# Altium schematic sheet DHT11_蓝牙模块_蜂鸣器.SchDoc
size A3
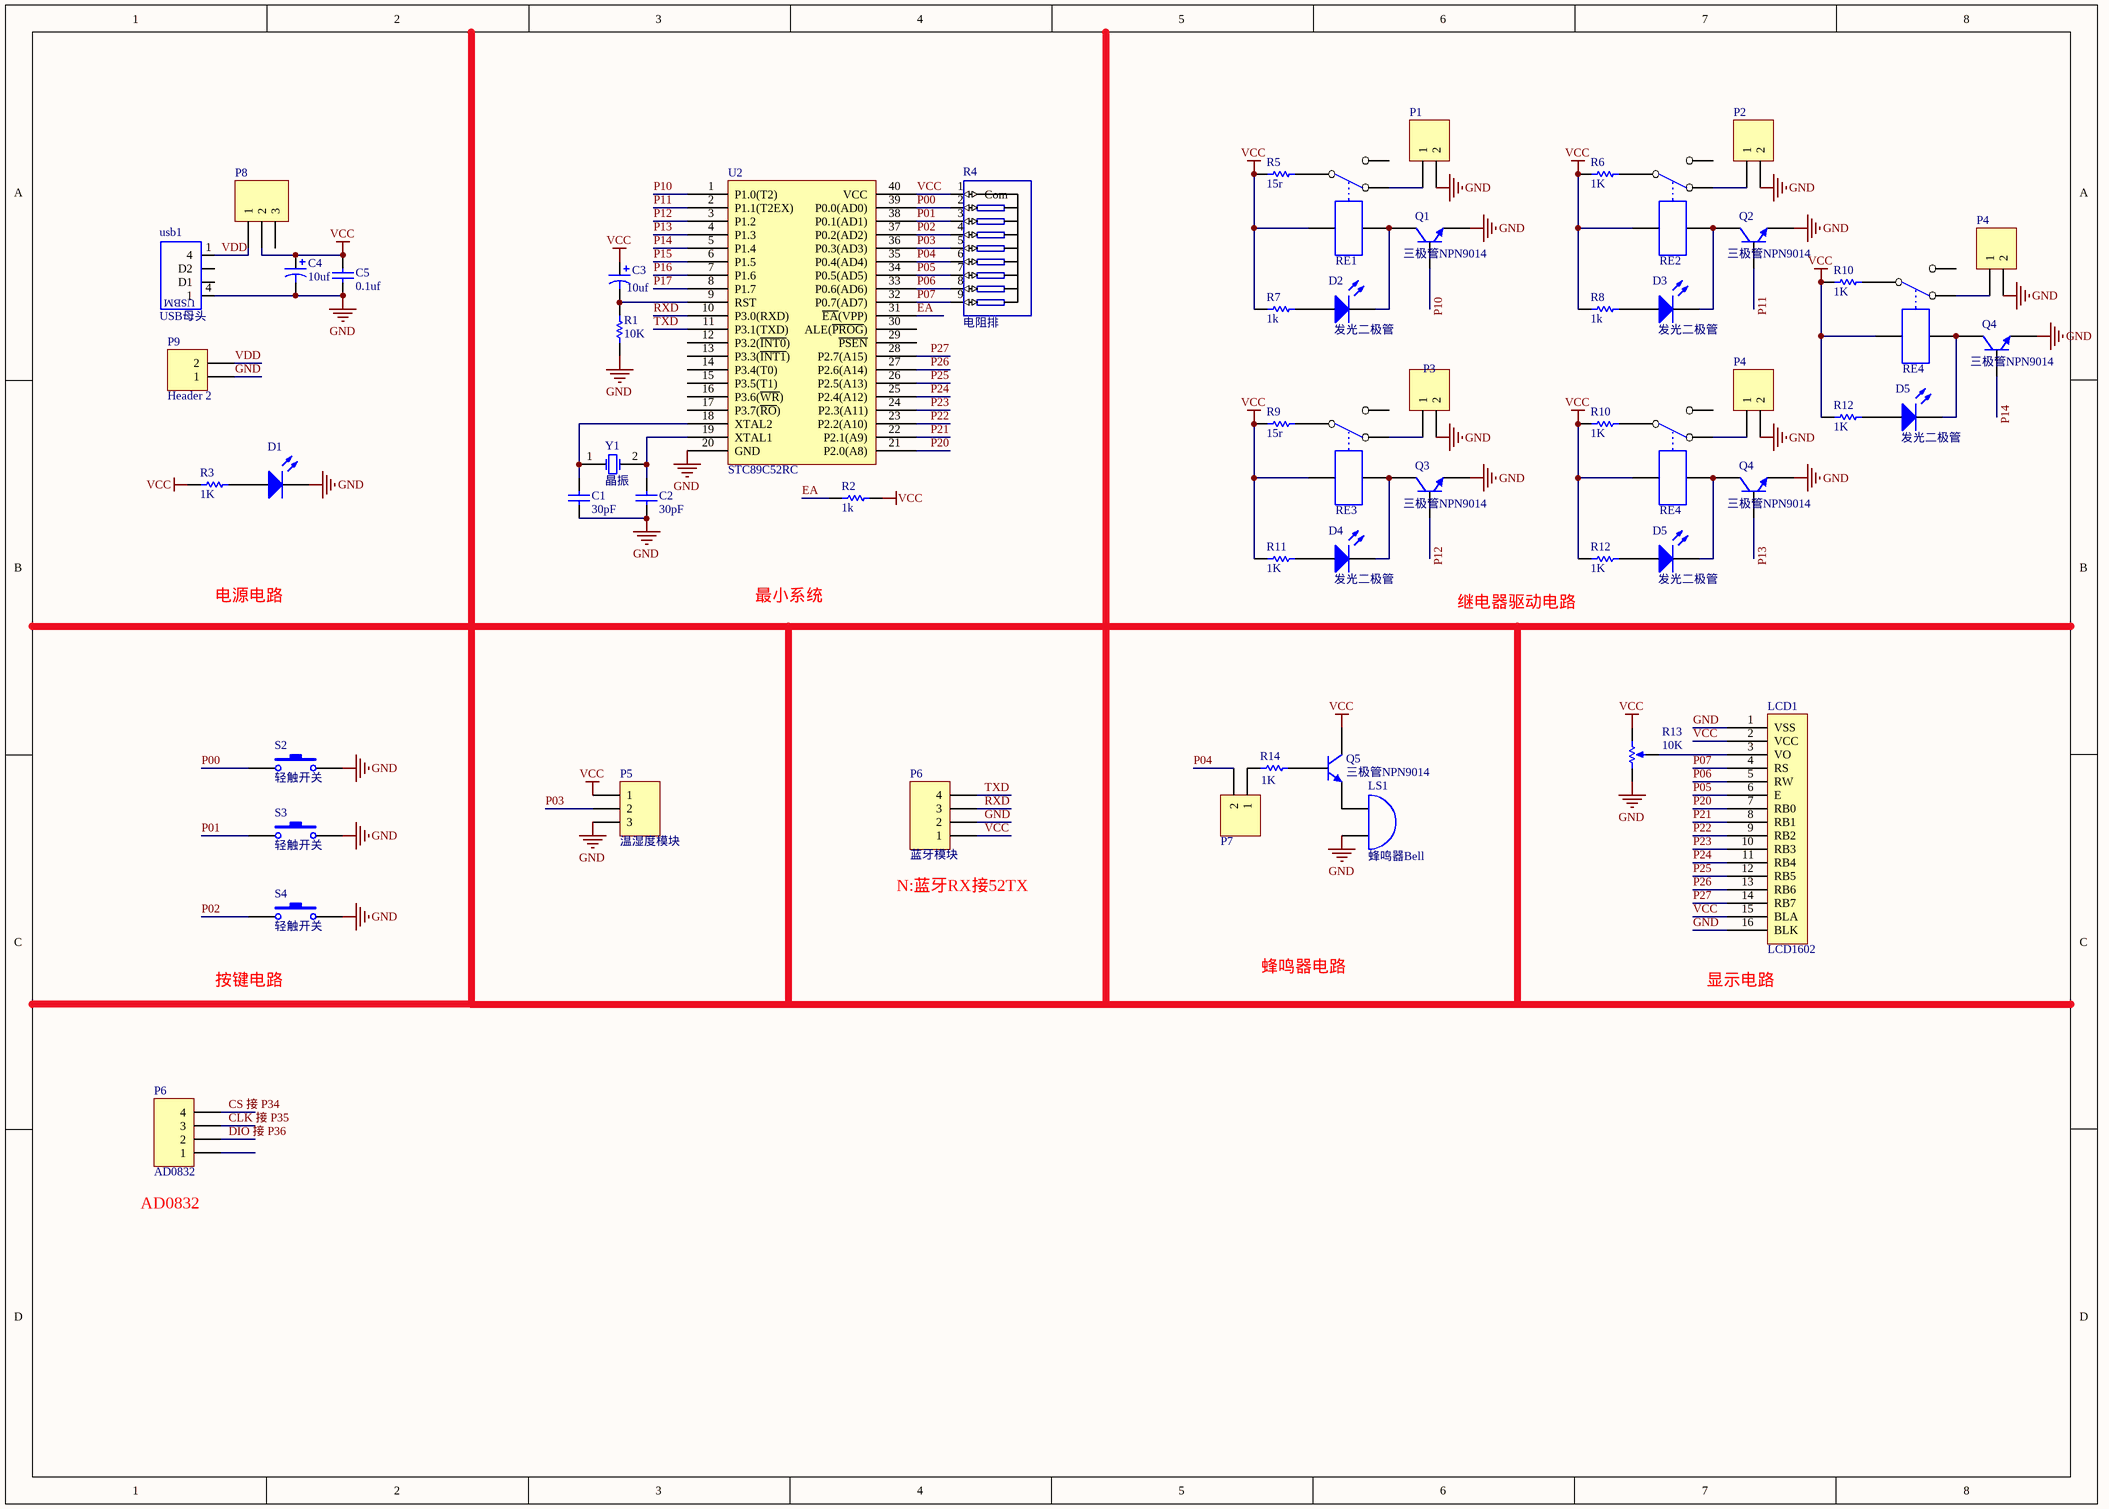
[diagram p0: DHT11_蓝牙模块_蜂鸣器.SchDoc]

## Parts
(Parts that share a designator on the sheet are numbered #1, #2 ... from top to bottom, then left to right.)
C1  value 30pF  [RAD-0.1]  (hidden comment: 瓷片电容)
C2  value 30pF  [RAD-0.1]  (hidden comment: 瓷片电容)
C3  value 10uf  [10UF]  (hidden comment: 电解电容)
C4  value 10uf  [10UF]  (hidden comment: 点解电容)
C5  value 0.1uf  [CB1]  (hidden comment: 瓷片电容)
D1  发光二极管  [LED_2.54]  (value not drawn)
D2  发光二极管  [LED_2.54]
D3  发光二极管  [LED_2.54]
D4  发光二极管  [LED_2.54]
D5#1  发光二极管  [LED_2.54]
D5#2  发光二极管  [LED_2.54]
LCD1  LCD1602  [1602LCD]
LS1  蜂鸣器Bell  [有源蜂鸣器4.9]
P1  接线端子  [端子2P]  (value not drawn)
P2  接线端子  [端子2P]  (value not drawn)
P3  接线端子  [端子2P]  (value not drawn)
P4#1  接线端子  [端子2P]  (value not drawn)
P4#2  接线端子  [端子2P]  (value not drawn)
P5  温湿度模块  [HDR1X3]
P6#1  蓝牙模块  [HDR1X4]
P6#2  AD0832  [HDR1X4]
P7  Header 2  [HDR1X2]  (value not drawn)
P8  Header 3  [HDR1X3]  (value not drawn)
P9  Header 2  [HDR1X2]
Q1  三极管NPN9014  [NEWTO-92]
Q2  三极管NPN9014  [NEWTO-92]
Q3  三极管NPN9014  [NEWTO-92]
Q4#1  三极管NPN9014  [NEWTO-92]
Q4#2  三极管NPN9014  [NEWTO-92]
Q5  三极管NPN9014  [NEWTO-92]
R1  value 10K  [电阻0.7-1.6]  (hidden comment: 电阻)
R2  value 1k  [电阻0.7-1.6]  (hidden comment: 电阻)
R3  value 1K  [电阻0.7-1.6]  (hidden comment: 电阻)
R4  电阻排  [插槽P9]
R5  value 15r  [电阻0.7-1.6]  (hidden comment: 电阻)
R6  value 1K  [电阻0.7-1.6]  (hidden comment: 电阻)
R7  value 1k  [电阻0.7-1.6]  (hidden comment: 电阻)
R8  value 1k  [电阻0.7-1.6]  (hidden comment: 电阻)
R9  value 15r  [电阻0.7-1.6]  (hidden comment: 电阻)
R10#1  value 1K  [电阻0.7-1.6]  (hidden comment: 电阻)
R10#2  value 1K  [电阻0.7-1.6]  (hidden comment: 电阻)
R11  value 1K  [电阻0.7-1.6]  (hidden comment: 电阻)
R12#1  value 1K  [电阻0.7-1.6]  (hidden comment: 电阻)
R12#2  value 1K  [电阻0.7-1.6]  (hidden comment: 电阻)
R13  value 10K  [可调电阻5mm]  (hidden comment: 电位器RPot)
R14  value 1K  [电阻0.7-1.6]  (hidden comment: 电阻)
RE1  继电器  [继电器5V]  (value not drawn)
RE2  继电器  [继电器5V]  (value not drawn)
RE3  继电器  [继电器5V]  (value not drawn)
RE4#1  继电器  [继电器5V]  (value not drawn)
RE4#2  继电器  [继电器5V]  (value not drawn)
S2  轻触开关  [轻触开关小]
S3  轻触开关  [轻触开关小]
S4  轻触开关  [轻触开关小]
U2  STC89C52RC  [DIP-40W]
usb1  USB母头  [A母USB]
Y1  晶振  [XTAL]

## Nets
GND: C1.1 C2.1 C4.2 C5.1 D1.2(K) LCD1.1(VSS) LCD1.16(BLK) LS1.2(B) P1.2 P2.2 P3.2 P4#1.2 P4#2.2 P5.3 P6#1.2 P9.1 Q1.3(E) Q2.3(E) Q3.3(E) Q4#1.3(E) Q4#2.3(E) R1.1 R13.1(TOP) S2.2 S3.2 S4.2 U2.20(GND) usb1.4(1)
VCC: C3.1 C4.1 C5.2 LCD1.2(VCC) LCD1.15(BLA) P5.1 P6#1.1 P8.2 Q5.1(C) R2.1 R3.2 R4.1(Com) R5.1 R6.1 R7.2 R8.2 R9.1 R10#1.1 R10#2.1 R11.2 R12#1.2 R12#2.2 R13.2(BOT) RE1.4 RE2.4 RE3.4 RE4#1.4 RE4#2.4 U2.40(VCC)
CLK 接 P35: P6#2.3
CS 接 P34: P6#2.4
DIO 接 P36: P6#2.2
EA: R2.2 U2.31(~{EA}(VPP))
P00: R4.2 S2.1 U2.39(P0.0(AD0))
P01: R4.3 S3.1 U2.38(P0.1(AD1))
P02: R4.4 S4.1 U2.37(P0.2(AD2))
P03: P5.2 R4.5 U2.36(P0.3(AD3))
P04: P7.2 R4.6 U2.35(P0.4(AD4))
P05: LCD1.6(E) R4.7 U2.34(P0.5(AD5))
P06: LCD1.5(RW) R4.8 U2.33(P0.6(AD6))
P07: LCD1.4(RS) R4.9 U2.32(P0.7(AD7))
P10: Q1.2(B) U2.1(P1.0(T2))
P11: Q2.2(B) U2.2(P1.1(T2EX))
P12: Q3.2(B) U2.3(P1.2)
P13: Q4#2.2(B) U2.4(P1.3)
P14: Q4#1.2(B) U2.5(P1.4)
P15: U2.6(P1.5)
P16: U2.7(P1.6)
P17: U2.8(P1.7)
P20: LCD1.7(RB0) U2.21(P2.0(A8))
P21: LCD1.8(RB1) U2.22(P2.1(A9))
P22: LCD1.9(RB2) U2.23(P2.2(A10))
P23: LCD1.10(RB3) U2.24(P2.3(A11))
P24: LCD1.11(RB4) U2.25(P2.4(A12))
P25: LCD1.12(RB5) U2.26(P2.5(A13))
P26: LCD1.13(RB6) U2.27(P2.6(A14))
P27: LCD1.14(RB7) U2.28(P2.7(A15))
RXD: P6#1.3 U2.10(P3.0(RXD))
TXD: P6#1.4 U2.11(P3.1(TXD))
VDD: P8.1 P9.2 usb1.1(4)
NetC1_2: C1.2 U2.18(XTAL2) Y1.1(OSC1)
NetC2_2: C2.2 U2.19(XTAL1) Y1.2(OSC2)
NetC3_2: C3.2 R1.2 U2.9(RST)
NetD1_1: D1.1(A) R3.1
NetD2_1: D2.1(A) R7.1
NetD2_2: D2.2(K) Q1.1(C) RE1.5
NetD3_1: D3.1(A) R8.1
NetD3_2: D3.2(K) Q2.1(C) RE2.5
NetD4_1: D4.1(A) R11.1
NetD4_2: D4.2(K) Q3.1(C) RE3.5
NetD5#1_1: D5#1.1(A) R12#1.1
NetD5#1_2: D5#1.2(K) Q4#1.1(C) RE4#1.5
NetD5#2_1: D5#2.1(A) R12#2.1
NetD5#2_2: D5#2.2(K) Q4#2.1(C) RE4#2.5
NetLCD1_3: LCD1.3(VO) R13.3(TAP)
NetLS1_1: LS1.1(A) Q5.3(E)
NetP1_1: P1.1 RE1.3
NetP2_1: P2.1 RE2.3
NetP3_1: P3.1 RE3.3
NetP4#1_1: P4#1.1 RE4#1.3
NetP4#2_1: P4#2.1 RE4#2.3
NetP7_1: P7.1 R14.1
NetQ5_2: Q5.2(B) R14.2
NetR5_2: R5.2 RE1.1
NetR6_2: R6.2 RE2.1
NetR9_2: R9.2 RE3.1
NetR10#1_2: R10#1.2 RE4#1.1
NetR10#2_2: R10#2.2 RE4#2.1

Not connected (* = marked no-connect by the designer): P6#2 1; P8 3; RE1 2; RE2 2; RE3 2; RE4#1 2; RE4#2 2; U2 12(P3.2(~{INT0})) 13(P3.3(~{INT1})) 14(P3.4(T0)) 15(P3.5(T1)) 16(P3.6(~{WR})) 17(P3.7(~{RO})) 29(~{PSEN}) 30(ALE(~{PROG})); usb1 D1 D2

## Notes on the sheet
- 电源电路
- 最小系统
- 继电器驱动电路
- (near P6#1) N:蓝牙RX接52TX
- 按键电路
- 蜂鸣器电路
- (near LCD1) 显示电路
- (near P6#2) AD0832
- (in symbol USB) USBM

## Library data of the parts
C1 C2 C5 = Cap: Capacitor; Published: 8-Jun-2000; LatestRevisionDate: 17-Jul-2002; LatestRevisionNote: Re-released for DXP Platform.; PackageReference: RAD-0.3; Publisher: Altium Limited; PackageDescription: Radial Cap, Thru-Hole; 2 Leads; 0.3 in Pin Spacing
C3 C4 = Cap Pol1: Polarized Capacitor (Radial); Published: 8-Jun-2000; LatestRevisionDate: 17-Jul-2002; LatestRevisionNote: Re-released for DXP Platform.; PackageReference: RB7.6-15; Publisher: Altium Limited; PackageDescription: Polarized Capacitor (Radial); 2 Leads
D1-D4 D5#1 D5#2 = LED0: Typical INFRARED GaAs LED; Published: 8-Jun-2000; LatestRevisionDate: 08-Jul-2005; LatestRevisionNote: Mech Layer 1 removed.; PackageReference: LED-0; Publisher: Altium Limited; PackageDescription: LED; 2 Leads
LS1 = Bell: Electrical Bell; Published: 24-Mar-1999; LatestRevisionDate: 17-Jul-2002; LatestRevisionNote: Re-released for DXP Platform.; PackageReference: PIN2; Publisher: Altium Limited
P1-P3 P4#1 P4#2 P7 P9 = Header 2: Header, 2-Pin; LatestRevisionDate: 17-Jul-2002; LatestRevisionNote: Re-released for DXP Platform.; Publisher: Altium Limited
P5 P8 = Header 3: Header, 3-Pin; LatestRevisionDate: 17-Jul-2002; LatestRevisionNote: Re-released for DXP Platform.; Publisher: Altium Limited
P6#1 P6#2 = Header 4: Header, 4-Pin; LatestRevisionDate: 17-Jul-2002; LatestRevisionNote: Re-released for DXP Platform.; Publisher: Altium Limited
Q1-Q3 Q4#1 Q4#2 Q5 = NPN: NPN Bipolar Transistor; Published: 8-Jun-2000; LatestRevisionDate: 17-Jul-2002; LatestRevisionNote: Re-released for DXP Platform.; PackageReference: TO-226-AA; Publisher: Altium Limited; PackageDescription: TO, Flat Index; 3 In-Line, Axial Leads; Body Dia. 4.8mm; Leads 0.55 x 0.51 mm (max); Code_JEDEC: TO-226-AA
R1-R3 R5-R9 R10#1 R10#2 R11 R12#1 R12#2 R14 = Res1: Resistor; Published: 8-Jun-2000; LatestRevisionDate: 17-Jul-2002; LatestRevisionNote: Re-released for DXP Platform.; PackageReference: AXIAL-0.3; Publisher: Altium Limited; PackageDescription: Axial Device, Thru-Hole; 2 Leads; 0.3 in Pin Spacing
R4 = RES10
R13 = RPot: Potentiometer; Sim Note: Enter the Resistance value and the set point into parameter fields.; Set Position: 0.5; Published: 8-Jun-2000; LatestRevisionDate: 17-Jul-2002; LatestRevisionNote: Re-released for DXP Platform.; PackageReference: VR5; Publisher: Altium Limited; PackageDescription: Variable Resistor, Thru-Hole; 3 Leads
RE1-RE3 RE4#1 RE4#2 = RELAY5V
S2-S4 = SW-PB: Switch; Published: 24-Mar-1999; LatestRevisionDate: 17-Jul-2002; LatestRevisionNote: Re-released for DXP Platform.; PackageReference: SPST-2; Publisher: Altium Limited; PackageDescription: Switch; 2 Leads
U2 = 89C52
usb1 = USB
Y1 = XTAL: Crystal Oscillator; Published: 8-Jun-2000; LatestRevisionDate: 17-Jul-2002; LatestRevisionNote: Re-released for DXP Platform.; PackageReference: R38; Publisher: Altium Limited; PackageDescription: Crystal, Thru-Hole; 2 Leads; Body 3.1 x 8.2 mm (Dia.xH)